# EAGLE design mcp3008_rpi_Dirty_july_2015 (EAGLE 7.2.0)
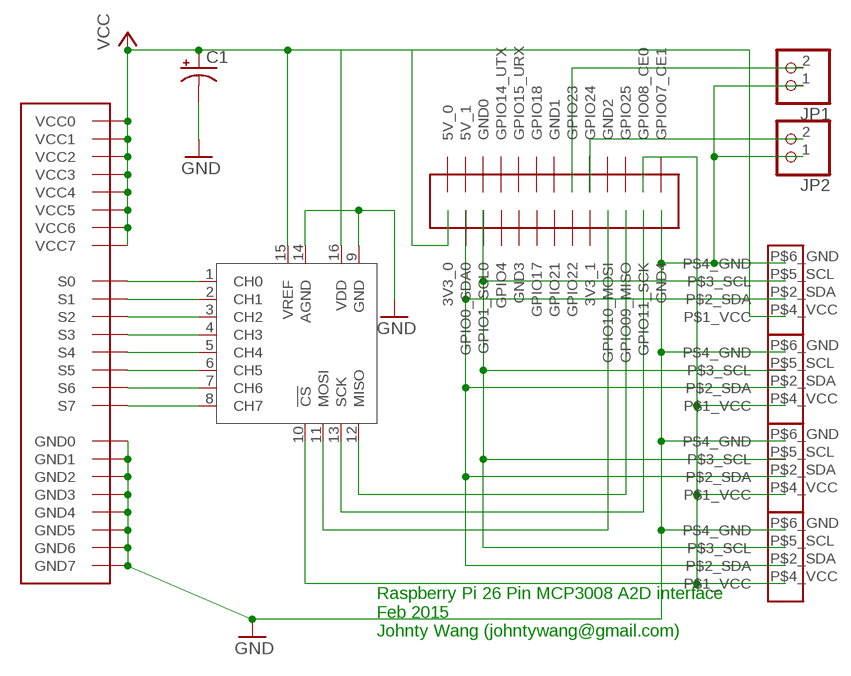
[diagram p0: schematic, sheet 1]

## Parts
C1  CPOL-USE2.5-6  [E2,5-6]
JP1  PINHD-1X2  [1X02]
JP2  PINHD-1X2  [1X02]
U$1  3BY83X8_SAMTEC  [3X8_PKG]
U$2  RPI_26  [RPI26]
U$3  MCP3008P  [DIL16]
U$4  ICUBE_I2C  [2X3]
U$5  ICUBE_I2C  [2X3]
U$6  ICUBE_I2C  [2X3]
U$7  ICUBE_I2C  [2X3]

## Nets
GND: C1.- JP1.1 JP2.1 U$1.GND0 U$1.GND1 U$1.GND2 U$1.GND3 U$1.GND4 U$1.GND5 U$1.GND6 U$1.GND7 U$2.GND4 U$3.9(GND) U$3.14(AGND) U$4.P$6_GND(P$4_GND) U$5.P$6_GND(P$4_GND) U$6.P$6_GND(P$4_GND) U$7.P$6_GND(P$4_GND)
N$1: U$1.S0 U$3.1(CH0)
N$2: U$1.S1 U$3.2(CH1)
N$3: U$1.S2 U$3.3(CH2)
N$4: U$1.S3 U$3.4(CH3)
N$5: U$1.S4 U$3.5(CH4)
N$6: U$1.S5 U$3.6(CH5)
N$7: U$1.S6 U$3.7(CH6)
N$8: U$1.S7 U$3.8(CH7)
N$9: U$2.GPIO09(GPIO09_MISO) U$3.12(MISO)
N$10: U$2.GPIO11(GPIO11_SCK) U$3.13(SCK)
N$11: U$2.GPIO10(GPIO10_MOSI) U$3.11(MOSI)
N$12: U$2.GPIO08(GPIO08_CE0) U$3.10(!CS) U$5.P$4_VCC(P$1_VCC) U$6.P$4_VCC(P$1_VCC) U$7.P$4_VCC(P$1_VCC)
N$13: JP1.2 U$2.GPIO23
N$14: U$2.GPIO01(GPIO1_SCL0) U$4.P$5_SCL(P$3_SCL) U$5.P$5_SCL(P$3_SCL) U$6.P$5_SCL(P$3_SCL) U$7.P$5_SCL(P$3_SCL)
N$15: U$2.GPIO0(GPIO0_SDA0) U$4.P$2_SDA U$5.P$2_SDA U$6.P$2_SDA U$7.P$2_SDA
N$16: JP2.2 U$2.GPIO24
VCC: C1.+ U$1.VCC0 U$1.VCC1 U$1.VCC2 U$1.VCC3 U$1.VCC4 U$1.VCC5 U$1.VCC6 U$1.VCC7 U$2.3V3_0 U$3.15(VREF) U$3.16(VDD) U$4.P$4_VCC(P$1_VCC)
Unconnected: U$2.3V3_1 U$2.5V1(5V_1) U$2.GND0 U$2.GND1 U$2.GND2 U$2.GND3 U$2.GPIO04(GPIO4) U$2.GPIO07(GPIO07_CE1) U$2.GPIO14(GPIO14_UTX) U$2.GPIO15(GPIO15_URX) U$2.GPIO17 U$2.GPIO18 U$2.GPIO21 U$2.GPIO22 U$2.GPIO25

## Notes on the sheet
- Raspberry Pi 26 Pin MCP3008 A2D interface
  Feb 2015
  Johnty Wang (johntywang@gmail.com)

## Power pins joined to a net without a drawn wire
5V_0: U$2.5V0(5V_0)

## Library data of the parts
C1 = rcl:CPOL-US: POLARIZED CAPACITOR, American symbol
JP1 JP2 = pinhead:PINHD-1X2: PIN HEADER
U$1 = jt_lib:3BY8: a 3 by 8 header
U$2 = jt_lib:RPI_26: RPi GPIO header (26 pin)
U$3 = MCP3008:MCP3008
U$4-U$7 = jt_lib:ICUBE_I2C: 2x3 pin header for ICubeX i2c sensors

## Net classes
0 default: width 0.254 mm

## Board
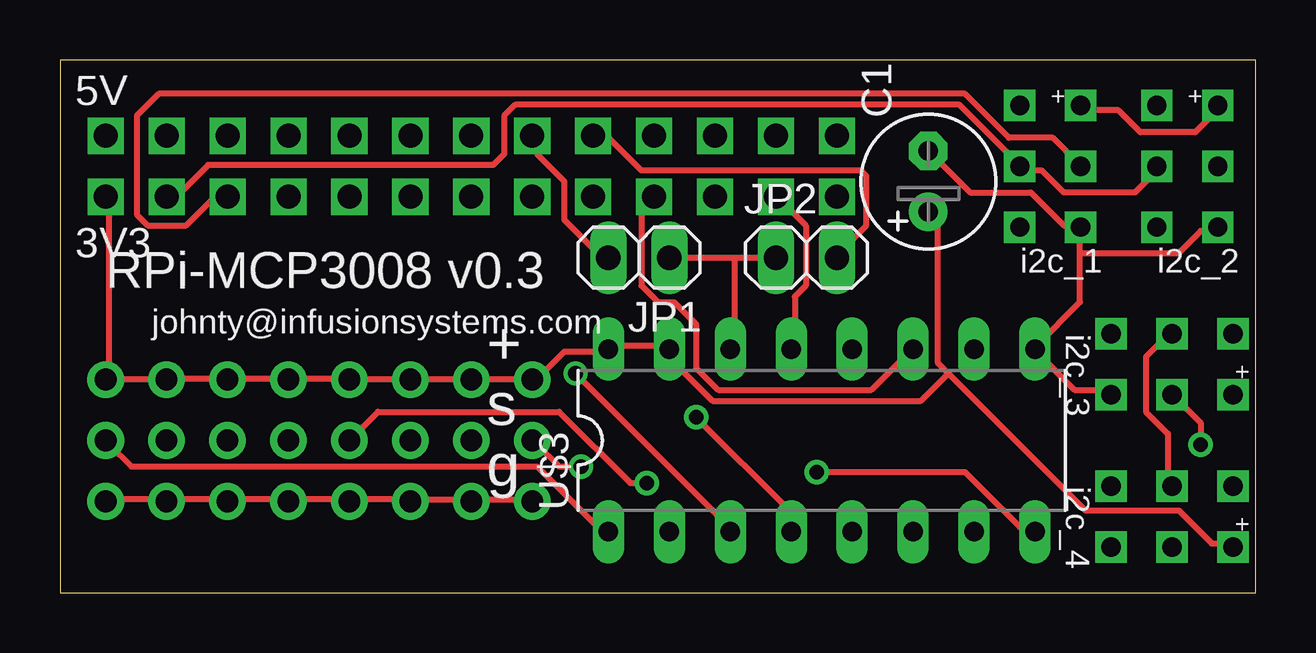
[diagram p1: board, top side]
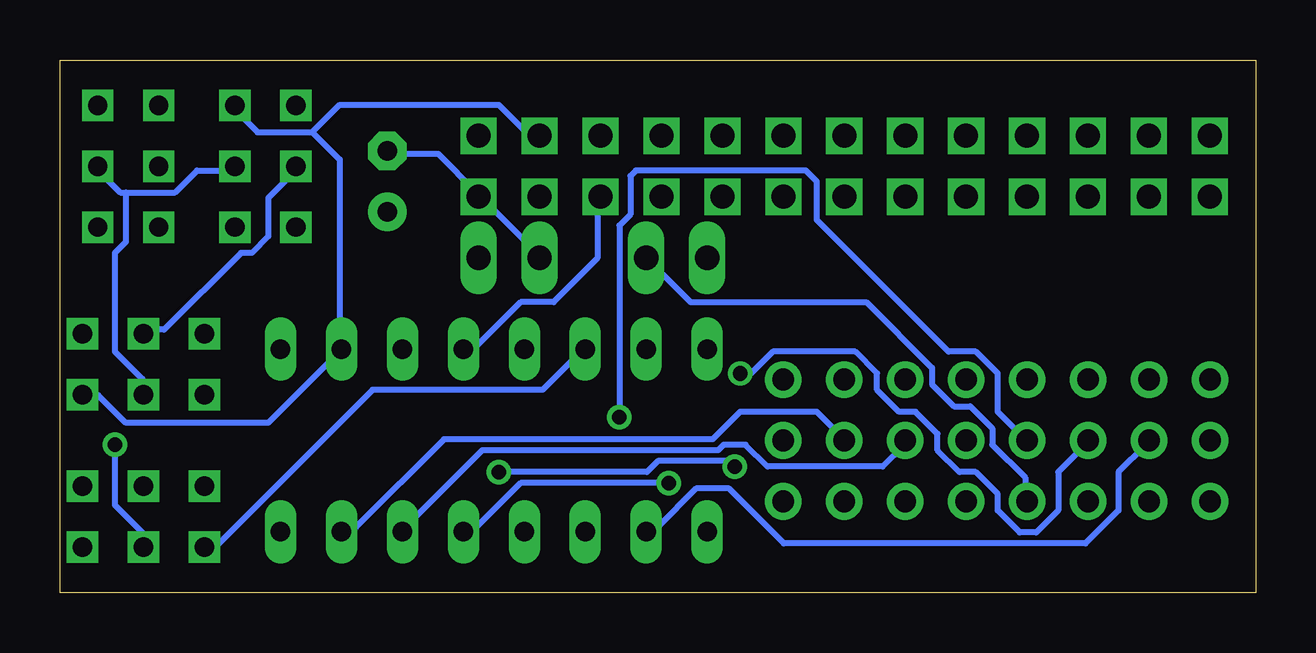
[diagram p2: board, bottom side, seen from below]

Size 49.84 x 22.21 mm. Coordinates in mm from the lower left corner, seen from the top.
Outline: 0,0 49.84,0 49.84,22.21 0,22.21 0,0
Copper layers (1*16): Top 0.035mm / dielectric 1.5mm / Bottom 0.035mm
Design rules "default": minimum track width 10mil, minimum drill 24mil, track to track 8mil, track to pad 8mil, pad to pad 8mil, via to via 8mil, smd to smd 8mil, copper to edge 40mil, drill to drill 8mil, minimum pad ring 10mil, minimum via ring 8mil, stop-mask expansion 4mil, vias tented up to drill 0mil, thermal gap 10mil

### Footprints (pad centres in the part's own frame; a part is rotated, then mirrored left to right if it is on the bottom)
E2,5-6 = drill 0.813 pad 1.6: + -1.27,0 | drill 0.813 pad 1.6 octagon: - 1.27,0
1X02 = drill 1.016 long: 1 -1.27,0; 2 1.27,0
3X8_PKG = drill 0.9 pad 1.524: GND0 -5.08,-3.81; GND1 -2.54,-3.81; GND2 0,-3.81; GND3 2.54,-3.81; GND4 5.08,-3.81; GND5 7.62,-3.81; GND6 10.16,-3.81; GND7 12.7,-3.81; S0 -5.08,-1.27; S1 -2.54,-1.27; S2 0,-1.27; S3 2.54,-1.27; S4 5.08,-1.27; S5 7.62,-1.27; S6 10.16,-1.27; S7 12.7,-1.27; VCC0 -5.08,1.27; VCC1 -2.54,1.27; VCC2 0,1.27; VCC3 2.54,1.27; VCC4 5.08,1.27; VCC5 7.62,1.27; VCC6 10.16,1.27; VCC7 12.7,1.27
RPI26 = drill 1 square: 3V3_0 -13.97,-1.27; 3V3_1 6.35,-1.27; 5V0 -13.97,1.27; 5V1 -11.43,1.27; GND0 -8.89,1.27; GND1 1.27,1.27; GND2 8.89,1.27; GND3 -3.81,-1.27; GND4 16.51,-1.27; GPIO0 -11.43,-1.27; GPIO01 -8.89,-1.27; GPIO04 -6.35,-1.27; GPIO07 16.51,1.27; GPIO08 13.97,1.27; GPIO09 11.43,-1.27; GPIO10 8.89,-1.27; GPIO11 13.97,-1.27; GPIO14 -6.35,1.27; GPIO15 -3.81,1.27; GPIO17 -1.27,-1.27; GPIO18 -1.27,1.27; GPIO21 1.27,-1.27; GPIO22 3.81,-1.27; GPIO23 3.81,1.27; GPIO24 6.35,1.27; GPIO25 11.43,1.27
DIL16 = drill 0.813 long: 1 -8.89,-3.81; 2 -6.35,-3.81; 3 -3.81,-3.81; 4 -1.27,-3.81; 5 1.27,-3.81; 6 3.81,-3.81; 7 6.35,-3.81; 8 8.89,-3.81; 9 8.89,3.81; 10 6.35,3.81; 11 3.81,3.81; 12 1.27,3.81; 13 -1.27,3.81; 14 -3.81,3.81; 15 -6.35,3.81; 16 -8.89,3.81
2X3 = drill 0.8 square: P$1 -1.27,2.54; P$2_SDA -1.27,0; P$3 -1.27,-2.54; P$4_VCC 1.27,2.54; P$5_SCL 1.27,0; P$6_GND 1.27,-2.54

### Placement (x,y rotation side)
C1  36.2,17.14 90 top
JP1  24.13,13.97 180 top
JP2  31.11,13.97 0 top
U$1  6.99,7.62 0 top
U$2  15.88,17.78 0 top
U$3  31.75,6.35 0 top
U$4  46.35,3.17 270 top
U$5  46.35,9.53 270 top
U$6  41.27,17.78 0 top
U$7  46.99,17.78 0 top

### Tracks (layer width: path | path; a pad name or v marks a point on that pad's centre or on a via)
GND
  Top 0.254: U$1.GND0 2.06,3.89 4.34,3.89 U$1.GND1 4.57,3.89 6.86,3.89 U$1.GND2 7.09,3.89 9.37,3.89 U$1.GND3 9.6,3.89 11.89,3.89 U$1.GND4 12.12,3.89 14.4,3.89 U$1.GND5 14.63,3.89 17.14,3.89 | 17.14,3.89 19.66,3.89 U$1.GND7 | 17.14,3.89 U$1.GND6 | U$5.P$6_GND 43.66,8.46 42.29,8.46 40.69,10.06 U$3.9 40.69,10.29 42.52,12.12 42.52,14.17 | 42.52,14.17 42.52,15.09 U$6.P$6_GND 42.52,15.32 41.83,15.32 40.46,16.69 37.95,16.69 36.35,18.29 C1.- | 42.52,14.17 46.63,14.17 47.55,15.09 48.23,15.09 U$7.P$6_GND | 28.12,13.95 29.72,13.95 JP2.1 | 28.12,13.95 25.6,13.95 JP1.1 | 28.12,13.95 28.12,10.29 U$3.14
  Bottom 0.254: U$4.P$6_GND 43.66,2.06 43.2,2.06 36.8,8.46 29.72,8.46 28.12,10.06 U$3.14 | JP2.1 29.95,14.17 32.23,16.46 U$2.GND4 32.46,16.69 34.06,18.29 36.12,18.29 C1.- | JP1.1 23.55,12.12 16.23,12.12 13.49,9.37 13.49,8.69 12.57,7.77 11.89,7.77 10.97,6.86 10.97,6.17 9.6,4.8 9.6,3.89 U$1.GND3
N$1
  Top 0.254: U$3.1 22.86,2.74 22.4,2.74 19.89,5.26 2.97,5.26 2.06,6.17 U$1.S0
N$2
  Bottom 0.254: U$3.2 25.38,2.74 24.92,2.74 23.32,4.34 21.95,4.34 19.66,2.06 7.09,2.06 5.71,3.43 5.71,5.03 4.57,6.17 U$1.S1
N$3  (via drill 0.61)
  Top 0.254: v21.49,9.14 27.89,2.74 U$3.3
  Bottom 0.254: v21.49,9.14 21.03,9.14 20.12,10.06 16.69,10.06 15.77,9.14 15.77,8.46 14.86,7.54 14.17,7.54 13.26,6.63 13.26,5.94 12.34,5.03 11.66,5.03 10.74,4.12 10.74,3.43 9.83,2.52 9.14,2.52 8.23,3.43 8.23,5.03 7.09,6.17 U$1.S2
N$4  (via drill 0.61)
  Top 0.254: v26.52,7.32 30.4,3.43 30.4,2.74 U$3.4
  Bottom 0.254: v26.52,7.32 26.52,15.32 26.06,15.77 26.06,17.37 25.83,17.6 18.75,17.6 18.29,17.14 18.29,15.54 12.8,10.06 11.66,10.06 10.74,9.14 10.74,7.54 9.6,6.4 U$1.S3
N$5  (via drill 0.61)
  Top 0.254: v24.46,4.57 23.77,4.57 20.8,7.54 13.26,7.54 U$1.S4
  Bottom 0.254: v24.46,4.57 30.63,4.57 32.46,2.74 32.92,2.74 U$3.5
N$6
  Bottom 0.254: U$3.6 35.43,2.74 32.23,5.94 22.4,5.94 22.17,6.17 21.26,6.17 20.34,5.26 15.54,5.26 14.63,6.17 U$1.S5
N$7
  Bottom 0.254: U$3.7 37.95,2.74 37.49,2.74 33.83,6.4 22.63,6.4 21.49,7.54 18.29,7.54 17.14,6.4 U$1.S6
N$8  (via drill 0.61)
  Top 0.254: v31.55,5.03 37.72,5.03 40.01,2.74 40.46,2.74 U$3.8 | v21.72,5.26 20.8,5.26 19.89,6.17 U$1.S7
  Bottom 0.254: v31.55,5.03 25.38,5.03 24.92,5.49 21.95,5.49 v21.72,5.26
N$9
  Bottom 0.254: U$3.12 32.92,10.29 32.46,10.29 30.63,12.12 29.26,12.12 27.43,13.95 27.43,16.46 U$2.GPIO09
N$10
  Top 0.254: U$3.13 30.63,10.29 30.63,12.34 31.09,12.8 31.09,15.32 29.95,16.46 U$2.GPIO11
N$11
  Top 0.254: U$3.11 35.43,10.06 33.83,8.46 27.43,8.46 26.52,9.37 26.52,11.2 25.6,12.12 24.92,12.12 24.23,12.8 24.23,16 24.69,16.46 U$2.GPIO10
N$12
  Top 0.254: U$6.P$4_VCC 42.75,20.12 44.12,20.12 45.03,19.2 47.32,19.2 48.23,20.12 U$7.P$4_VCC
  Bottom 0.254: U$5.P$4_VCC 48.69,8.23 48.23,8.23 47.09,7.09 41.15,7.09 38.18,10.06 U$3.10 38.18,10.29 38.18,18.06 39.32,19.2 | 39.32,19.2 38.18,20.34 31.55,20.34 30.4,19.2 29.95,19.2 U$2.GPIO08 | 39.32,19.2 41.6,19.2 42.52,20.12 U$6.P$4_VCC
N$13
  Top 0.254: U$2.GPIO23 19.89,18.97 19.89,18.29 21.03,17.14 21.03,15.54 22.4,14.17 22.86,14.17 JP1.2
N$14  (via drill 0.61)
  Top 0.254: v47.55,6.17 47.55,7.09 46.41,8.23 U$5.P$5_SCL | U$2.GPIO01 6.86,16.46 6.4,16.46 5.26,15.32 3.66,15.32 3.2,15.77 3.2,19.89 4.12,20.8 37.72,20.8 39.55,18.97 41.38,18.97 42.52,17.83 U$6.P$5_SCL
  Bottom 0.254: v47.55,6.17 47.55,3.66 46.41,2.52 46.41,2.06 U$4.P$5_SCL | 47.09,16.69 47.32,16.69 48.23,17.6 U$7.P$5_SCL | 47.09,16.69 45.03,16.69 44.12,17.6 42.75,17.6 U$6.P$5_SCL | 47.09,16.69 47.09,14.63 47.55,14.17 47.55,10.06 46.41,8.91 46.41,8.46 U$5.P$5_SCL
N$15
  Top 0.254: U$4.P$2_SDA 46.18,4.57 46.18,6.63 45.26,7.54 45.26,9.83 46.18,10.74 U$5.P$2_SDA | U$7.P$2_SDA 45.72,17.6 44.81,16.69 41.83,16.69 40.92,17.6 40.01,17.6 U$6.P$2_SDA 40.01,17.83 37.49,20.34 18.97,20.34 18.52,19.89 18.52,18.29 18.06,17.83 6.17,17.83 5.03,16.69 4.57,16.69 U$2.GPIO0
  Bottom 0.254: U$5.P$2_SDA 46.18,10.97 45.49,10.97 42.29,14.17 41.83,14.17 41.15,14.86 41.15,16.46 40.01,17.6 U$6.P$2_SDA
N$16
  Top 0.254: U$2.GPIO24 22.4,18.97 22.86,18.97 24.23,17.6 33.38,17.6 33.6,17.37 33.6,15.32 32.46,14.17 JP2.2
VCC
  Top 0.254: 37.03,9.14 36.58,9.6 36.58,15.54 36.35,15.77 C1.+ | 37.03,9.14 42.75,3.43 46.63,3.43 48.01,2.06 48.69,2.06 U$4.P$4_VCC | 2.06,8.91 2.06,16.46 U$2.3V3_0 | 2.06,8.91 4.34,8.91 U$1.VCC1 4.57,8.91 6.86,8.91 U$1.VCC2 7.09,8.91 9.37,8.91 U$1.VCC3 9.6,8.91 11.89,8.91 U$1.VCC4 12.12,8.91 14.4,8.91 U$1.VCC5 14.63,8.91 17.14,8.91 | 2.06,8.91 U$1.VCC0 | 17.14,8.91 19.66,8.91 U$1.VCC7 19.89,8.91 21.03,10.06 22.86,10.06 U$3.16 22.86,10.29 25.38,10.29 U$3.15 25.6,10.06 25.6,9.6 27.2,8 35.89,8 37.03,9.14 | 17.14,8.91 U$1.VCC6

### Text on the board
tNames: RPi-MCP3008 v0.3 | i2c_1 | i2c_2 | johnty@infusionsystems.com | i2c_3 | + | s | g | i2c_4